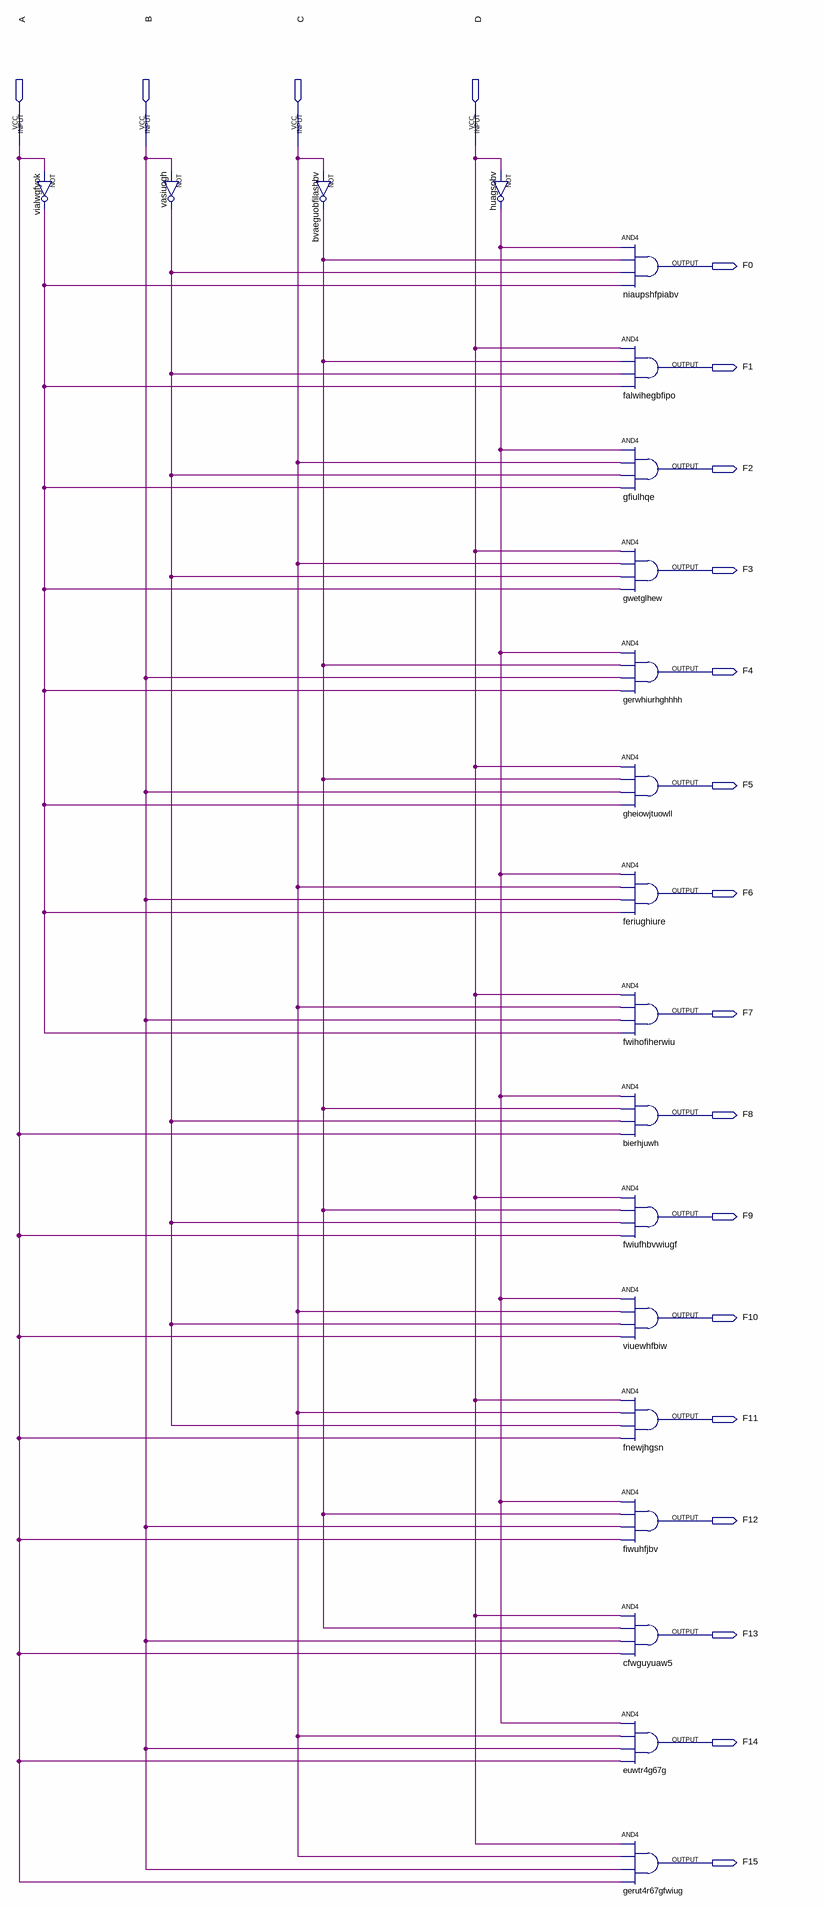
[diagram p0: schematic sheet]
// Quartus schematic Decod4-16.bdf as structural Verilog: 20 symbols, 20 pins
module \Decod4-16  (
  input  A,
  input  B,
  input  C,
  input  D,
  output F0,
  output F1,
  output F2,
  output F3,
  output F4,
  output F5,
  output F6,
  output F7,
  output F8,
  output F9,
  output F10,
  output F11,
  output F12,
  output F13,
  output F14,
  output F15
);

  wire bvaeguobfilashbv_out, huagsobv_out, vasiuogh_out, vialwgfyok_out;

  not vialwgfyok (vialwgfyok_out, A);
  not vasiuogh (vasiuogh_out, B);
  not bvaeguobfilashbv (bvaeguobfilashbv_out, C);
  not huagsobv (huagsobv_out, D);
  and niaupshfpiabv (F0, huagsobv_out, bvaeguobfilashbv_out, vasiuogh_out, vialwgfyok_out);
  and falwihegbfipo (F1, D, bvaeguobfilashbv_out, vasiuogh_out, vialwgfyok_out);
  and gfiulhqe (F2, huagsobv_out, C, vasiuogh_out, vialwgfyok_out);
  and gwetglhew (F3, D, C, vasiuogh_out, vialwgfyok_out);
  and gerwhiurhghhhh (F4, huagsobv_out, bvaeguobfilashbv_out, B, vialwgfyok_out);
  and gheiowjtuowll (F5, D, bvaeguobfilashbv_out, B, vialwgfyok_out);
  and feriughiure (F6, huagsobv_out, C, B, vialwgfyok_out);
  and fwihofiherwiu (F7, D, C, B, vialwgfyok_out);
  and bierhjuwh (F8, huagsobv_out, bvaeguobfilashbv_out, vasiuogh_out, A);
  and fwiufhbvwiugf (F9, D, bvaeguobfilashbv_out, vasiuogh_out, A);
  and viuewhfbiw (F10, huagsobv_out, C, vasiuogh_out, A);
  and fnewjhgsn (F11, D, C, vasiuogh_out, A);
  and fiwuhfjbv (F12, huagsobv_out, bvaeguobfilashbv_out, B, A);
  and cfwguyuaw5 (F13, D, bvaeguobfilashbv_out, B, A);
  and euwtr4g67g (F14, huagsobv_out, C, B, A);
  and gerut4r67gfwiug (F15, D, C, B, A);
endmodule
